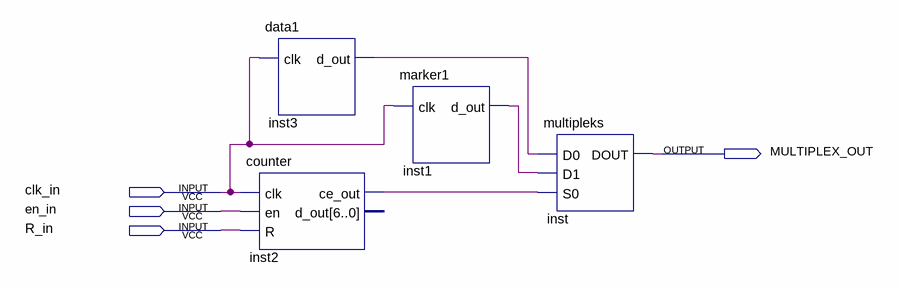
[diagram p0: schematic sheet]
// Quartus schematic block1.bdf as structural Verilog: 4 symbols, 4 pins
module block1 (
  input  clk_in,
  input  en_in,
  input  R_in,
  output MULTIPLEX_OUT
);

  wire inst1_d_out, inst2_ce_out, inst3_d_out;

  data1 inst3 (.clk(clk_in), .d_out(inst3_d_out));
  counter inst2 (.clk(clk_in), .en(en_in), .R(R_in), .ce_out(inst2_ce_out));  // open: d_out
  marker1 inst1 (.clk(clk_in), .d_out(inst1_d_out));
  multipleks inst (.D0(inst3_d_out), .D1(inst1_d_out), .S0(inst2_ce_out), .DOUT(MULTIPLEX_OUT));
endmodule
